# Altium schematic sheet 04 ZYNQ_BANK0.SchDoc
size A4
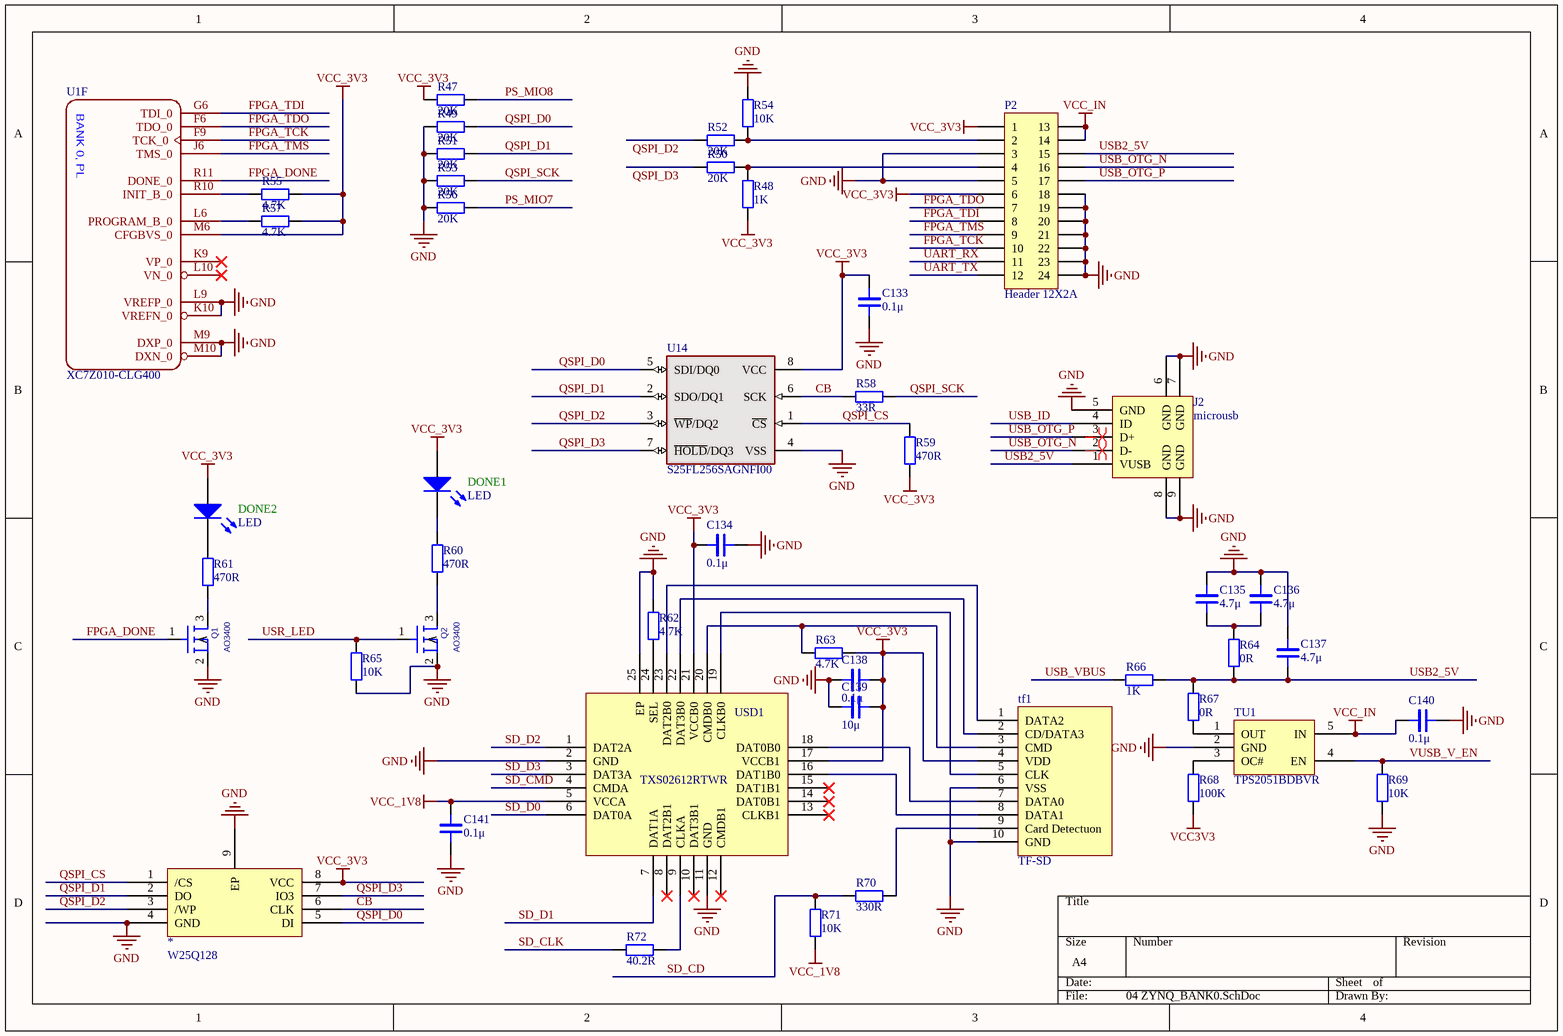
[diagram p0: 04 ZYNQ_BANK0.SchDoc]

## Parts
*  W25Q128  [W25Q256]
C133  0.1μ  [LC-0402_C]
C134  0.1μ  [LC-0402_C]
C135  4.7μ  [LC-0402_C]
C136  4.7μ  [LC-0402_C]
C137  4.7μ  [LC-0402_C]
C138  0.1μ  [LC-0402_C]
C139  10μ  [LC-0402_C]
C140  0.1μ  [LC-0402_C]
C141  0.1μ  [LC-0402_C]
DONE1  LED  [D0402]
DONE2  LED  [D0402]
J2  microusb  [micro usb]
P2  Header 12X2A  [HDR2X12_CEN]
Q1  AO3400  [NMOS]
Q2  AO3400  [NMOS]
R47  20K  [LC-0402_R]
R48  1K  [LC-0402_R]
R49  20K  [LC-0402_R]
R50  20K  [LC-0402_R]
R51  20K  [LC-0402_R]
R52  20K  [LC-0402_R]
R53  20K  [LC-0402_R]
R54  10K  [LC-0402_R]
R55  4.7K  [LC-0402_R]
R56  20K  [LC-0402_R]
R57  4.7K  [LC-0402_R]
R58  33R  [LC-0402_R]
R59  470R  [LC-0402_R]
R60  470R  [LC-0402_R]
R61  470R  [LC-0402_R]
R62  4.7K  [LC-0402_R]
R63  4.7K  [LC-0402_R]
R64  0R  [LC-0402_R]
R65  10K  [LC-0402_R]
R66  1K  [LC-0402_R]
R67  0R  [LC-0402_R]
R68  100K  [LC-0402_R]
R69  10K  [LC-0402_R]
R70  330R  [LC-0402_R]
R71  10K  [LC-0402_R]
R72  40.2R  [LC-0402_R]
tf1  TF-SD  [TF]
TU1  TPS2051BDBVR  [TPS2051BDBVR]
U1  XC7Z010-CLG400  [CLG400-0.8]  (part F of 8)
U14  S25FL256SAGNFI00  [MLP8]
USD1  TXS02612RTWR  [TXS02612RTWR]

## Nets
GND: *.4(GND) *.9(EP) C133.2 C134.2 C135.2 C136.2 C137.2 C138.2 C139.2 C140.1 C141.2 J2.5(GND) J2.6(GND) J2.7(GND) J2.8(GND) J2.9(GND) P2.3 P2.5 P2.18 P2.19 P2.20 P2.21 P2.22 P2.23 P2.24 Q1.2(S) Q2.2(S) R49.1 R51.1 R53.1 R54.2 R56.1 R62.1 R65.2 R69.2 tf1.6(VSS) tf1.10(GND) TU1.2(GND) U1.K10(VREFN_0) U1.L9(VREFP_0) U1.M9(DXP_0) U1.M10(DXN_0) U14.4(VSS) USD1.2(GND) USD1.11(GND) USD1.25(EP)
VCC3V3: R68.2
VCC_1V8: C141.1 R71.2 USD1.5(VCCA)
VCC_3V3: *.8(VCC) C133.1 C134.1 C138.1 C139.1 DONE1.1(A) DONE2.1(A) P2.1 P2.6 R47.1 R48.1 R55.1 R57.1 R59.2 R63.1 tf1.4(VDD) U1.M6(CFGBVS_0) U14.8(VCC) USD1.17(VCCB1) USD1.21(VCCB0)
VCC_IN: C140.2 P2.13 P2.14 TU1.5(IN)
CB: *.6(CLK) R58.1 U14.6(SCK)
FPGA_DONE: Q1.1(G) U1.R11(DONE_0)
FPGA_TCK: P2.10 U1.F9(TCK_0)
FPGA_TDI: P2.8 U1.G6(TDI_0)
FPGA_TDO: P2.7 U1.F6(TDO_0)
FPGA_TMS: P2.9 U1.J6(TMS_0)
PS_MIO7: R56.2
PS_MIO8: R47.2
QSPI_CS: *.1(/CS) R59.1 U14.1(~{CS})
QSPI_D0: *.5(DI) R49.2 U14.5(SDI/DQ0)
QSPI_D1: *.2(DO) R51.2 U14.2(SDO/DQ1)
QSPI_D2: *.3(/WP) R52.2 U14.3(~{WP}/DQ2)
QSPI_D3: *.7(IO3) R50.2 U14.7(~{HOLD}/DQ3)
QSPI_SCK: R53.2 R58.2
SD_CD: R70.2 R71.1
SD_CLK: R72.2
SD_CMD: USD1.4(CMDA)
SD_D0: USD1.6(DAT0A)
SD_D1: USD1.7(DAT1A)
SD_D2: USD1.1(DAT2A)
SD_D3: USD1.3(DAT3A)
UART_RX: P2.11
UART_TX: P2.12
USB2_5V: C137.1 J2.1(VUSB) P2.15 R64.2 R66.1 R67.1
USB_ID: J2.4(ID)
USB_OTG_N: J2.2(D-) P2.16
USB_OTG_P: J2.3(D+) P2.17
USB_VBUS: R66.2
USR_LED: Q2.1(G) R65.1
VUSB_V_EN: R69.1 TU1.4(EN)
NetC135_1: C135.1 C136.1 R64.1
NetDONE1_2: DONE1.2(K) R60.2
NetDONE2_2: DONE2.2(K) R61.2
NetP2_2: P2.2 R52.1 R54.1
NetP2_4: P2.4 R48.2 R50.1
NetQ1_3: Q1.3(D) R61.1
NetQ2_3: Q2.3(D) R60.1
NetR55_2: R55.2 U1.R10(INIT_B_0)
NetR57_2: R57.2 U1.L6(PROGRAM_B_0)
NetR62_2: R62.2 USD1.24(SEL)
NetR63_2: R63.2 tf1.3(CMD) USD1.20(CMDB0)
NetR67_2: R67.2 TU1.1(OUT)
NetR68_1: R68.1 TU1.3(OC#)
NetR70_1: R70.1 tf1.9(Card_Detectuon)
NetR72_1: R72.1 USD1.9(CLKA)
Nettf1_1: tf1.1(DATA2) USD1.23(DAT2B0)
Nettf1_2: tf1.2(CD/DATA3) USD1.22(DAT3B0)
Nettf1_5: tf1.5(CLK) USD1.19(CLKB0)
Nettf1_7: tf1.7(DATA0) USD1.18(DAT0B0)
Nettf1_8: tf1.8(DATA1) USD1.16(DAT1B0)

Not connected (* = marked no-connect by the designer): U1 K9(VP_0)* L10(VN_0)*; USD1 8(DAT2B1)* 10(DAT3B1)* 12(CMDB1)* 13(CLKB1)* 14(DAT0B1)* 15(DAT1B1)*

## Layout directives
differential pair: (no net found under the mark)

## Notes on the sheet
- (in symbol XC7Z010-CLG400, part F) BANK 0, PL

## Library data of the parts
C133-C141 = CAP_2: Capacitor
DONE1 DONE2 = LED0: Typical INFRARED GaAs LED; Published: 8-Jun-2000; LatestRevisionDate: 08-Jul-2005; LatestRevisionNote: Mech Layer 1 removed.; PackageReference: LED-0; Publisher: Altium Limited; PackageDescription: LED; 2 Leads
P2 = Header 12X2A: Header, 12-Pin, Dual row; LatestRevisionDate: 17-Jul-2002; LatestRevisionNote: Re-released for DXP Platform.; Publisher: Altium Limited
Q1 Q2 = AO3400: PSpiceTemplate: X^@REFDES %d %g %s @MODEL
R47-R72 = RES: Resistor
U14 = N25Q12-F8: Serial Flash Memory, 16Mbit, Low Voltage, 50MHz SPI Bus Interface; Manufacturer: Spansion; DPN: *
tf1 = TF-SD: Parameter 1: *